# EAGLE design ExternalMotorController (EAGLE 6.4)

## Sheet 1 of 5
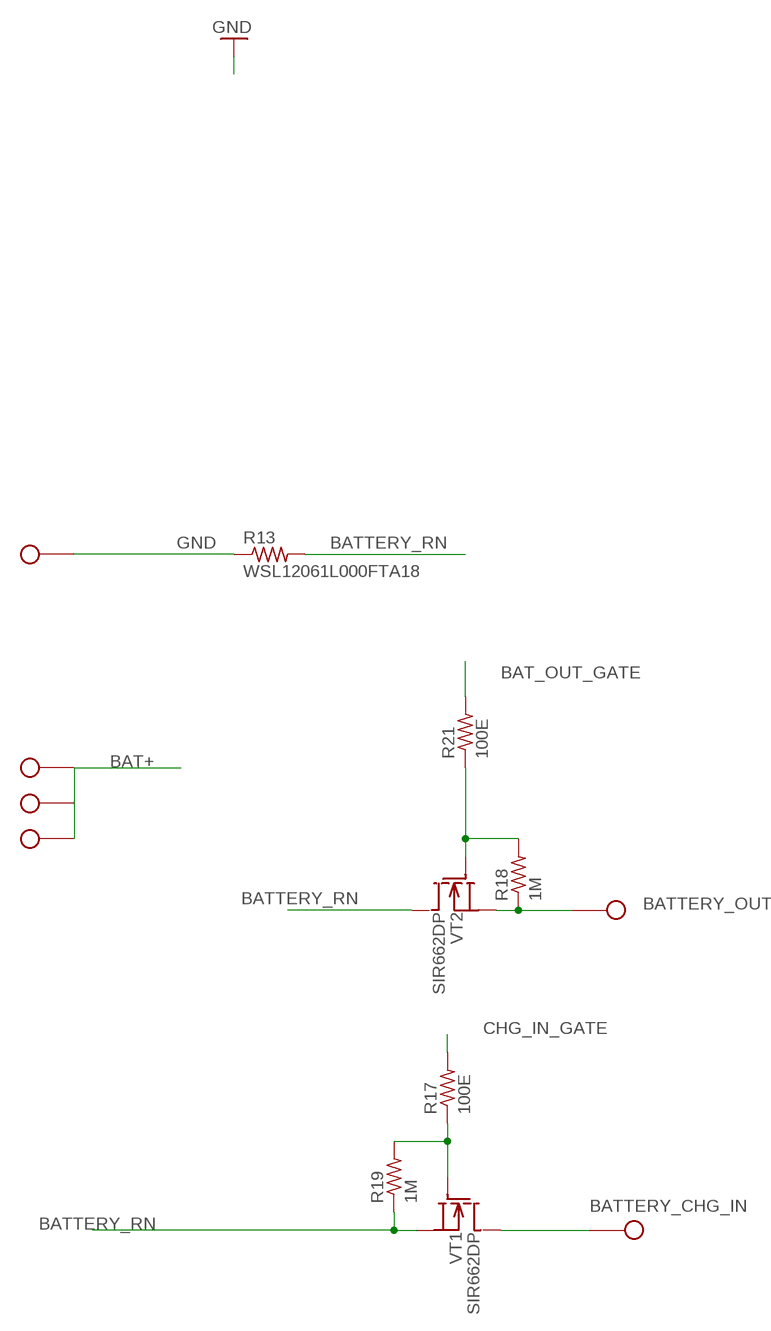
[diagram p0: schematic, sheet 1]

### Parts
R13  WSL12061L000FTA18  R-US_R2512  [R2512]
R17  100E  R-US_R0402  [R0402]
R18  1M  R-US_R0402  [R0402]
R19  1M  R-US_R0402  [R0402]
R21  100E  R-US_R0402  [R0402]
VT1  SIR662DP  [POWERPAK_SO8]
VT2  SIR662DP  [POWERPAK_SO8]
X1  SOLDER_HOLE18AWG  [SOLDER_HOLE_18]
X2  SOLDER_HOLE18AWG  [SOLDER_HOLE_18]
X3  SOLDER_HOLE18AWG  [SOLDER_HOLE_18]
X4  SOLDER_HOLE18AWG  [SOLDER_HOLE_18]
X5  SOLDER_HOLE18AWG  [SOLDER_HOLE_18]
X13  SOLDER_HOLE18AWG  [SOLDER_HOLE_18]

### Nets
BAT+: X1.1 X4.1 X5.1 ; also sheet 3,4
BAT_OUT_GATE: R21.2 ; also sheet 5
BATTERY_CHG_IN: VT1.D X2.1
BATTERY_OUT: R18.1 VT2.S1(S) VT2.S2(S) VT2.S3(S) X3.1 ; also sheet 5
BATTERY_RN: R13.2 R19.1 VT1.S1(S) VT1.S2(S) VT1.S3(S) VT2.D ; also sheet 5
CHG_IN_GATE: R17.2 ; also sheet 5
GND: R13.1 X13.1 ; also sheet 3,4,5
N$24: R18.2 R21.1 VT2.G
N$25: R17.1 R19.2 VT1.G

## Sheet 2 of 5

## Sheet 3 of 5
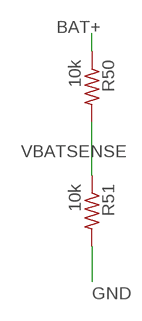
[diagram p1: schematic, sheet 3]

### Parts
R50  10k  R-US_R0402  [R0402]
R51  10k  R-US_R0402  [R0402]

### Nets
BAT+: R50.1 ; also sheet 1,4
GND: R51.2 ; also sheet 1,4,5
VBATSENSE: R50.2 R51.1 ; also sheet 5

## Sheet 4 of 5
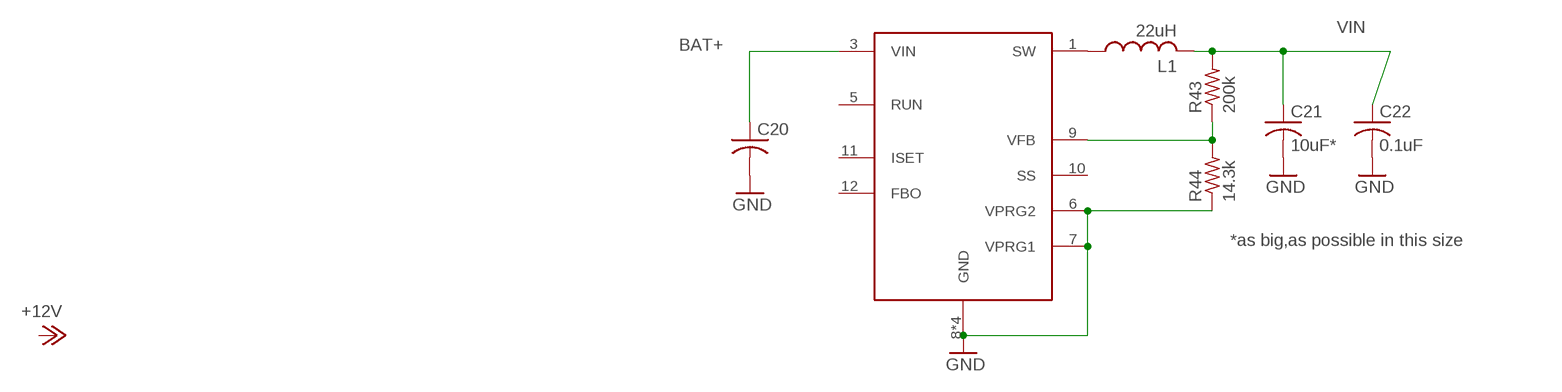
[diagram p2: schematic, sheet 4]

### Parts
C20  RCL_C-USC0805  [RCL_C0805$1]
C21  10uF*  RCL_C-USC4532  [RCL_C4532$1]
C22  0.1uF  C-USC0402  [C0402]
DA2  LTC3630  [MSE16(12)]
L1  22uH  M-PAD-2.1_L_USD  [M-PAD-2.1_1210]
R43  200k  RCL_R-US_R0402  [RCL_R0402]
R44  14.3k  RCL_R-US_R0402  [RCL_R0402]

### Nets
BAT+: C20.1 DA2.3(VIN) ; also sheet 1,3
GND: C20.2 C21.2 C22.2 DA2.6(VPRG2) DA2.7(VPRG1) DA2.8(GND) DA2.14(GND) DA2.16(GND) DA2.17(GND) R44.1 ; also sheet 1,3,5
N$51: DA2.1(SW) L1.1
N$52: DA2.9(VFB) R43.1 R44.2
VIN: C21.1 C22.1 L1.2 R43.2 ; also sheet 5
Unconnected: DA2.5(RUN) DA2.10(SS) DA2.11(ISET) DA2.12(FBO)

### Notes on the sheet
- *as big,as possible in this size

## Sheet 5 of 5
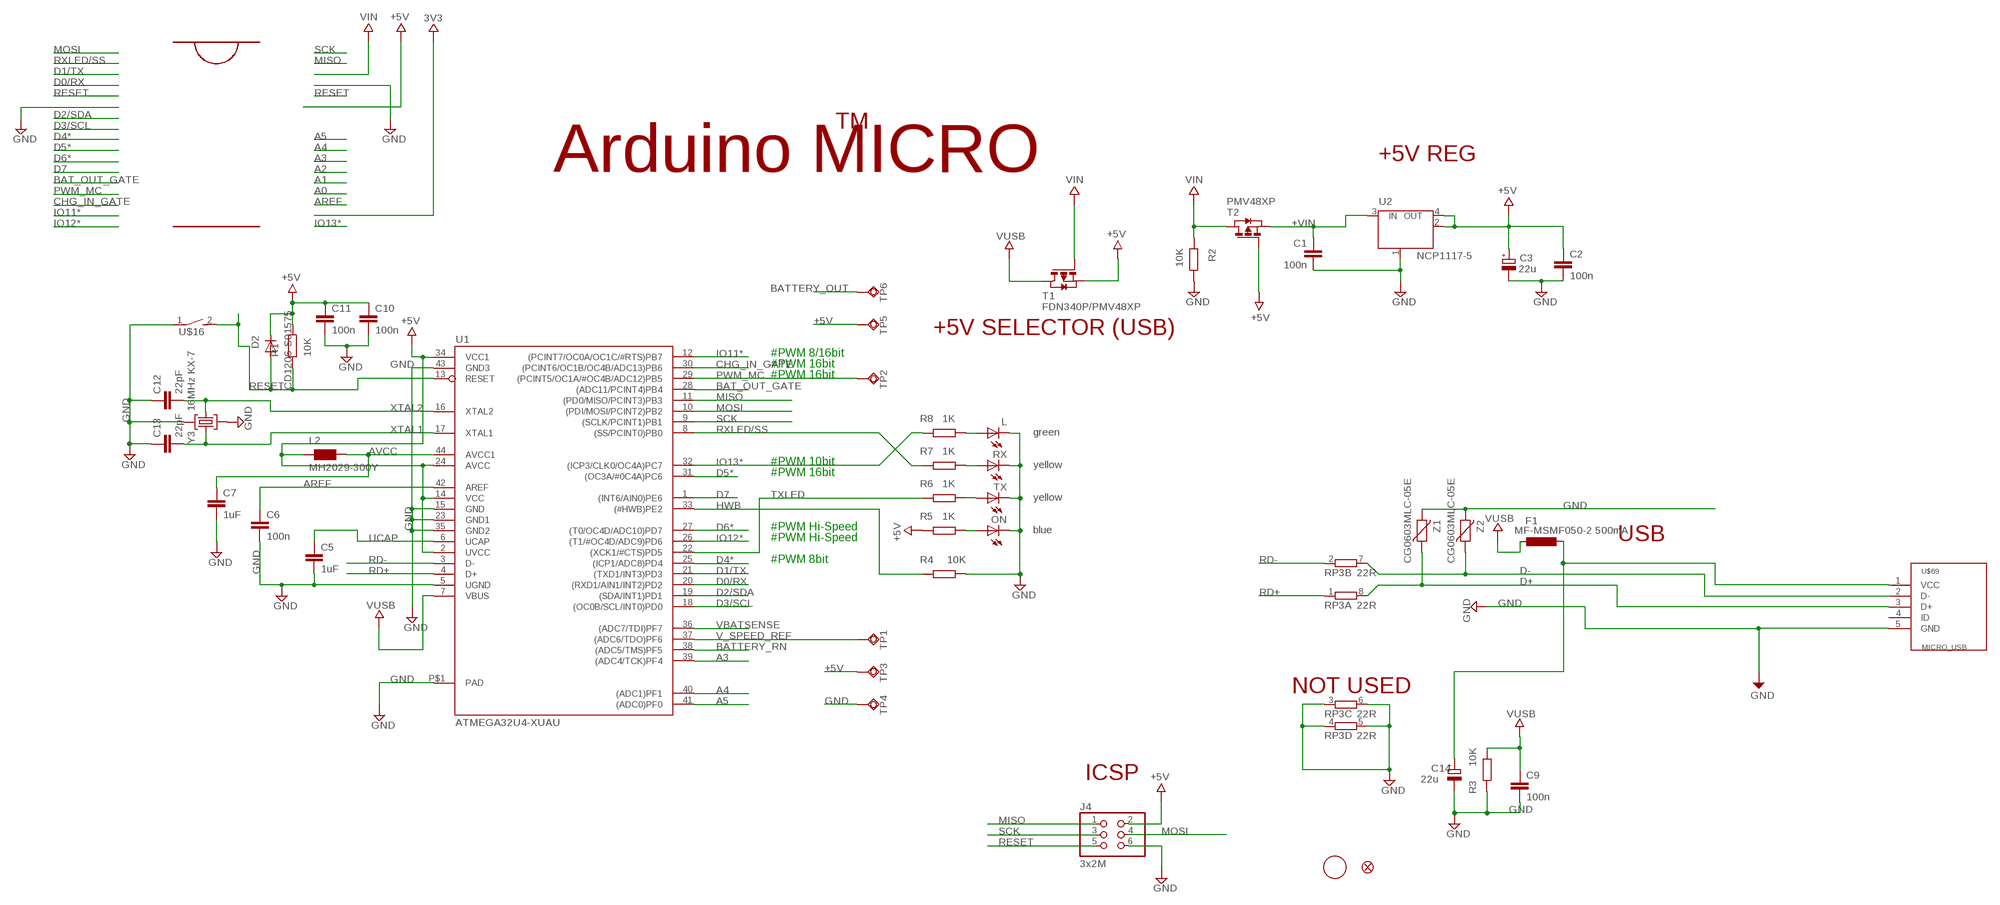
[diagram p3: schematic, sheet 5]

### Parts
C1  100n  C-EUC0402  [C0402]
C2  100n  C-EUC0402  [C0402]
C3  22u  CPOL-EUSMCB  [SMC_B]
C5  1uF  C-EUC0402  [C0402]
C6  100n  C-EUC0402  [C0402]
C7  1uF  C-EUC0402  [C0402]
C9  100n  C-EUC0402  [C0402]
C10  100n  C-EUC0402  [C0402]
C11  100n  C-EUC0402  [C0402]
C12  22pF  C-EUC0402  [C0402]
C13  22pF  C-EUC0402  [C0402]
C14  22u  CPOL-EUSMCB  [SMC_B]
D2  CD1206-S01575  DIODE-MINIMELF  [MINIMELF]
F1  MF-MSMF050-2 500mA  L-EUL1812  [L1812]
J4  3x2M  PINHD-2X3  [2X03]
L  green  LEDCHIPLED_0805  [CHIPLED_0805]
L2  MH2029-300Y  WE-CBF_0805  [0805]
ON  blue  LEDCHIPLED_0805  [CHIPLED_0805]
R1  10K  R-EU_R0402  [R0402]
R2  10K  R-EU_R0402  [R0402]
R3  10K  R-EU_R0402  [R0402]
R4  10K  R-EU_R0402  [R0402]
R5  1K  R-EU_R0402  [R0402]
R6  1K  R-EU_R0402  [R0402]
R7  1K  R-EU_R0402  [R0402]
R8  1K  R-EU_R0402  [R0402]
RP3  22R  4R-NCAY16  [CAY16]
RX  yellow  LEDCHIPLED_0805  [CHIPLED_0805]
T1  FDN340P/PMV48XP  PMOSSOT23  [SOT-23]
T2  PMV48XP  PMOSSOT23  [SOT-23]
TP1  TPSQTP15SQ  [TP15SQ]
TP2  TPSQTP15SQ  [TP15SQ]
TP3  TPSQTP15SQ  [TP15SQ]
TP4  TPSQTP15SQ  [TP15SQ]
TP5  TPSQTP15SQ  [TP15SQ]
TP6  TPSQTP15SQ  [TP15SQ]
TX  yellow  LEDCHIPLED_0805  [CHIPLED_0805]
U1  ATMEGA32U4-XUAU  [TQFP44-PAD]
U2  NCP1117-5  LINEAR_MC33269ST  [LINEAR_SOT223]
U$16  RGHT-ANGLE-SMT-SWITCH-688-SKRELF  [2.9X3.9X2.0]
U$37  FIDUCIALMOUNT  [FIDUCIA-MOUNT]
U$53  FIDUCIAL1X2  [FIDUCIAL-1X2]
U$69  MICRO_USB  [MICRO_USB]
Y3  16MHz KX-7  CRYSTAL-3.2-2.5  [CRYSTAL-3.2-2.5]
Z1  CG0603MLC-05E  VARISTORCN0603  [CT/CN0603]
Z2  CG0603MLC-05E  VARISTORCN0603  [CT/CN0603]

### Nets
+5V: C2.1 C3.+ C10.1 C11.1 D2.C J4.2 L2.1 R1.1 R5.1 T1.2(S) T2.3(G) TP3.TP TP5.TP U1.2(UVCC) U1.14(VCC) U1.24(AVCC) U1.34(VCC1) U2.2(OUT) U2.4(OUT)
+VIN: C1.1 T2.2(S) U2.3(IN)
A3: U1.39((ADC4/TCK)PF4)
A4: U1.40((ADC1)PF1)
A5: U1.41((ADC0)PF0)
AREF: C6.1 U1.42(AREF)
AVCC: C7.1 L2.2 U1.44(AVCC1)
BAT_OUT_GATE: U1.28((ADC11/PCINT4)PB4) ; also sheet 1
BATTERY_OUT: TP6.TP ; also sheet 1
BATTERY_RN: U1.38((ADC5/TMS)PF5) ; also sheet 1
CHG_IN_GATE: U1.30((PCINT6/OC1B/OC4B/ADC13)PB6) ; also sheet 1
D0/RX: U1.20((RXD1/AIN1/INT2)PD2)
D1/TX: U1.21((TXD1/INT3)PD3)
D2/SDA: U1.19((SDA/INT1)PD1)
D3/SCL: U1.18((OC0B/SCL/INT0)PD0)
D4*: U1.25((ICP1/ADC8)PD4)
D5*: U1.31((OC3A/#0C4A)PC6)
D6*: U1.27((T0/OC4D/ADC10)PD7)
D7: U1.1((INT6/AIN0)PE6)
D+: RP3.8 U$69.3(D+) Z1.1
D-: RP3.7 U$69.2(D-) Z2.1
GND: C1.2 C2.2 C3.- C5.2 C6.2 C7.2 C9.2 C10.2 C11.2 C12.1 C13.1 C14.- J4.6 L.C ON.C R2.1 R3.1 R4.2 RP3.3 RP3.4 RP3.5 RP3.6 RX.C TP4.TP TX.C U1.5(UGND) U1.15(GND) U1.23(GND1) U1.35(GND2) U1.43(GND3) U1.P$1(PAD) U2.1(GND/ADJ) U$16.1 U$69.5(GND) Y3.2(GND) Y3.4(GND) Z1.2 Z2.2 ; also sheet 1,3,4
HWB: R4.1 U1.33((#HWB)PE2)
IO11*: U1.12((PCINT7/OC0A/OC1C/#RTS)PB7)
IO12*: U1.26((T1/#OC4D/ADC9)PD6)
IO13*: R8.1 U1.32((ICP3/CLK0/OC4A)PC7)
MISO: J4.1 U1.11((PD0/MISO/PCINT3)PB3)
MOSI: J4.4 U1.10((PDI/MOSI/PCINT2)PB2)
N$2: R7.2 RX.A
N$3: ON.A R5.2
N$4: R6.2 TX.A
N$7: L.A R8.2
PWM_MC: TP2.TP U1.29((PCINT5/OC1A/#OC4B/ADC12)PB5)
RD+: RP3.1 U1.4(D+)
RD-: RP3.2 U1.3(D-)
RESET: D2.A J4.5 R1.2 U1.13(RESET) U$16.2
RXLED/SS: R7.1 U1.8((SS/PCINT0)PB0)
SCK: J4.3 U1.9((SCLK/PCINT1)PB1)
TXLED: R6.1 U1.22((XCK1/#CTS)PD5)
UCAP: C5.1 U1.6(UCAP)
V_SPEED_REF: TP1.TP U1.37((ADC6/TDO)PF6)
VBATSENSE: U1.36((ADC7/TDI)PF7) ; also sheet 3
VIN: R2.2 T1.3(G) T2.1(D) ; also sheet 4
VUSB: C9.1 F1.2 R3.2 T1.1(D) U1.7(VBUS)
VUSBD: C14.+ F1.1 U$69.1(VCC)
XTAL1: C13.2 U1.17(XTAL1) Y3.3(C2)
XTAL2: C12.2 U1.16(XTAL2) Y3.1(C1)
Unconnected: U$69.4(ID)

### Notes on the sheet
- TM
- +5V REG
- Arduino MICRO
- +5V SELECTOR (USB)
- #PWM 8/16bit
- #PWM 16bit
- #PWM 16bit
- #PWM 10bit
- #PWM 16bit
- #PWM Hi-Speed
- #PWM Hi-Speed | USB
- #PWM 8bit
- NOT USED
- ICSP

## Library data of the parts
C1 C2 C5-C7 C9-C13 = SmartPrj:C-EU: CAPACITOR, European symbol
C3 C14 = rcl:CPOL-EU: POLARIZED CAPACITOR, European symbol
C20 C21 = MotorController_r0:RCL_C-US: CAPACITOR, American symbol
C22 = rcl:C-US: CAPACITOR, American symbol
D2 = diode:DIODE-: DIODE
DA2 = my:LTC3630
F1 = rcl:L-EU: INDUCTOR, European symbol
J4 = SmartPrj:PINHD-2X3: PIN HEADER
L ON RX TX = led:LED: LED OSRAM: - CHIPLED LG R971, LG N971, LY N971, LG Q971, LY Q971, LO R971, LY R971 LH N974, LH R974 LS Q976, LO Q976, LY Q976 LO Q996 - Hyper CHIPLED LW Q18S LB Q993, LB Q99A, LB R99A - SideLED LS A670, LO A670, LY A670, LG A670, LP A670 LB A673, LV A673, LT A673, LW A673 LH A674 LY A675 LS A676, LA A676, LO A676, LY A676, LW A676 LS A679, LY A679, LG A679 - Hyper Micro SIDELED® LS Y876, LA Y876, LO Y876, LY Y876 LT Y87S - SmartLED LW L88C, LW L88S LB L89C, LB L89S, LG L890 LS L89K, LO L89K, LY L89K LS L896, LA L896, LO L896, LY L896 - TOPLED LS T670, LO T670, LY T670, LG T670, LP T670 LSG T670, LSP T670, LSY T670, LOP T670, LYG T670 LG T671, LOG T671, LSG T671 LB T673, LV T673, LT T673, LW T673 LH T674 LS T676, LA T676, LO T676, LY T676, LB T676, LH T676, LSB T676, LW T676 LB T67C, LV T67C, LT T67C, LS T67K, LO T67K, LY T67K, LW E67C LS E67B, LA E67B, LO E67B, LY E67B, LB E67C, LV E67C, LT E67C LW T67C LS T679, LY T679, LG T679 LS T770, LO T770, LY T770, LG T770, LP T770 LB T773, LV T773, LT T773, LW T773 LH T774 LS E675, LA E675, LY E675, LS T675 LS T776, LA T776, LO T776, LY T776, LB T776 LHGB T686 LT T68C, LB T68C - Hyper Mini TOPLED® LB M676 - Mini TOPLED Santana® LG M470 LS M47K, LO M47K, LY M47K Source: http://www.osram.convergy.de LUXEON: - LUMILED® LXK2-PW12-R00, LXK2-PW12-S00, LXK2-PW14-U00, LXK2-PW14-V00 LXK2-PM12-R00, LXK2-PM12-S00, LXK2-PM14-U00 LXK2-PE12-Q00, LXK2-PE12-R00, LXK2-PE12-S00, LXK2-PE14-T00, LXK2-PE14-U00 LXK2-PB12-K00, LXK2-PB12-L00, LXK2-PB12-M00, LXK2-PB14-N00, LXK2-PB14-P00, LXK2-PB14-Q00 LXK2-PR12-L00, LXK2-PR12-M00, LXK2-PR14-Q00, LXK2-PR14-R00 LXK2-PD12-Q00, LXK2-PD12-R00, LXK2-PD12-S00 LXK2-PH12-R00, LXK2-PH12-S00 LXK2-PL12-P00, LXK2-PL12-Q00, LXK2-PL12-R00 Source: www.luxeon.com KINGBRIGHT: KA-3528ASYC Source: www.kingbright.com
L1 = MotorController_r0:M-PAD-2.1_L_US: Inductors in various packages from: - Sumida - Panasonic - Coilcraft
L2 = wuerth-elektronik:WE-CBF: SMD EMI Suppression Ferrite Beads - excellent anti-EMI properties - low DCR - impedances till 3000 ohms - rated current up to 6 A
R1-R8 = SmartPrj:R-EU_: RESISTOR, European symbol
R13 R17-R19 R21 = ForBattery:R-US_: RESISTOR, American symbol
R43 R44 = MotorController_r0:RCL_R-US_: RESISTOR, American symbol
R50 R51 = rcl:R-US_: RESISTOR, American symbol
RP3 = resistor-dil:4R-N: Array Chip Resistor Source: RS Component / Phycomp
T1 T2 = zetex:PMOSSOT23: MOS FET
TP1-TP6 = testpad:TPSQ: Test pad
U1 = SmartPrj:ATMEGA32U4-XU
U2 = SmartPrj:LINEAR_MC33269ST*: Adjustable Output Low Dropout Voltage Regulator 800 mA Source: http://www.onsemi.com/pub/Collateral/MC33269-D.PDF
U$16 = m-pad-2.0:RGHT-ANGLE-SMT-SWITCH-688-SKRELF
U$37 = SmartPrj:FIDUCIALMOUNT
U$53 = SparkFun:FIDUCIAL: Fiducial Alignment Points Various fiducial points for machine vision alignment.
U$69 = camera_project:MICRO_USB
VT1 VT2 = ForBattery:SIR662DP
X1-X5 X13 = ForBattery:SOLDER_HOLE
Y3 = SmartPrj:CRYSTAL-3.2-2.5
Z1 Z2 = varistor:VARISTOR: VARISTOR

## Board
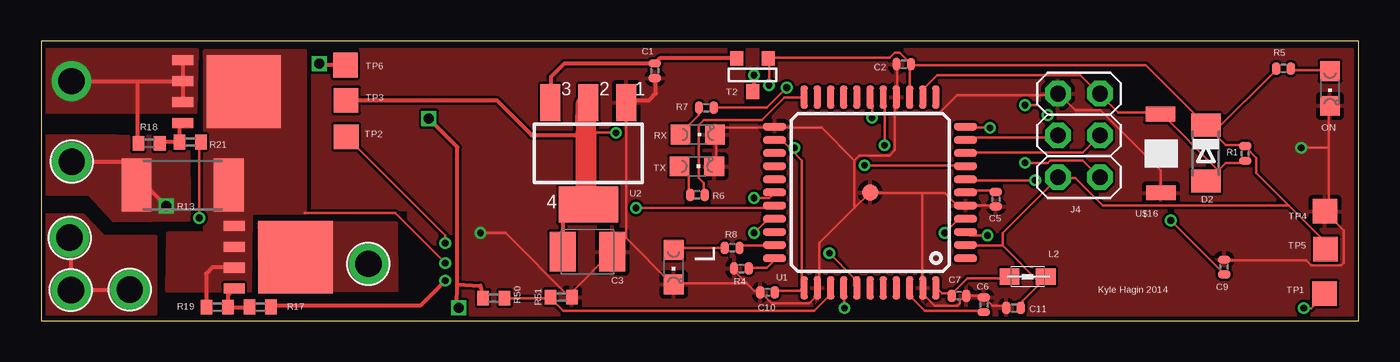
[diagram p4: board, top side]
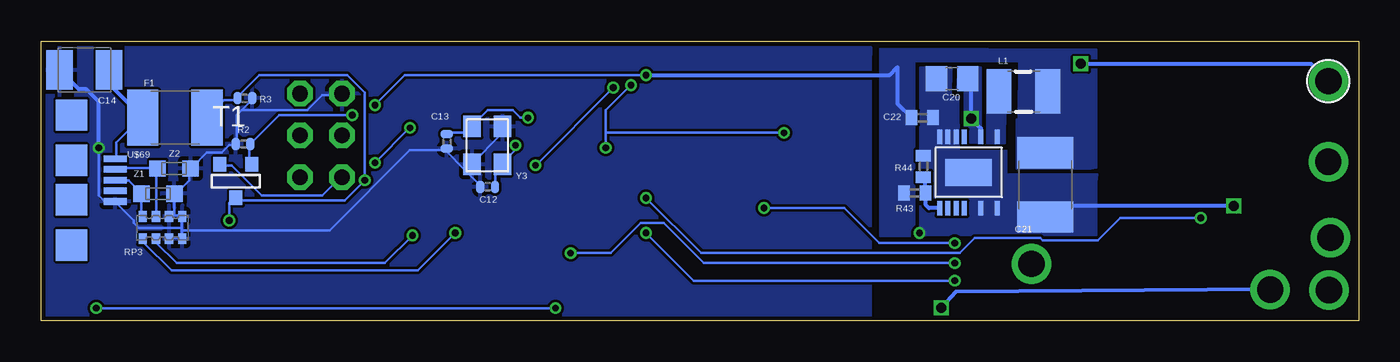
[diagram p5: board, bottom side, seen from below]

Size 80 x 17 mm. Coordinates in mm from the lower left corner, seen from the top.
Outline: 0,0 80,0 80,17 0,17 0,0
Copper layers (1*16): Top 0.035mm / dielectric 1.5mm / Bottom 0.035mm
Design rules "default *": minimum track width 6mil, minimum drill 16mil, track to track 6mil, track to pad 6mil, pad to pad 6mil, via to via 6mil, smd to smd 6mil, copper to edge 10mil, drill to drill 8mil, minimum pad ring 6mil, minimum via ring 6mil, stop-mask expansion 4mil, vias tented up to drill 0mil, thermal gap 10mil

### Footprints (pad centres in the part's own frame; a part is rotated, then mirrored left to right if it is on the bottom)
C0402 = smd 0.508 x 0.762: 1 -0.445,0; 2 0.445,0
SMC_B = smd 1.6 x 2.4: + -1.5,0; - 1.5,0
RCL_C0805$1 = smd 1.3 x 1.5: 1 -0.95,0; 2 0.95,0
RCL_C4532$1 = smd 1.9 x 3.4: 1 -1.95,0; 2 1.95,0
C0402' = smd 0.7 x 0.9: 1 -0.65,0; 2 0.65,0
MINIMELF = smd 1.4 x 1.8: A 1.7,0; C -1.7,0
MSE16(12) = smd 0.305 x 0.889: 1 -1.75,-2.171; 3 -0.75,-2.171; 5 0.25,-2.171; 6 0.75,-2.171; 7 1.25,-2.171; 8 1.75,-2.171; 9 1.75,2.171; 10 1.25,2.171; 11 0.75,2.171; 12 0.25,2.171; 14 -0.75,2.171; 16 -1.75,2.171 | smd 2.845 x 1.651: 17 0,0
L1812 = smd 1.9 x 3.4: 1 -1.95,0; 2 1.95,0
2X03 = drill 0.95 pad 1.55 octagon: 1 -2.54,-1.27; 2 -2.54,1.27; 3 0,-1.27; 4 0,1.27; 5 2.54,-1.27; 6 2.54,1.27
CHIPLED_0805 = smd 1.2 x 1.2: A 0,-1.05; C 0,1.05
M-PAD-2.1_1210 = smd 1.5 x 2.7: 1 -1.5,0; 2 1.45,0
0805 = smd 1.2 x 1: 1 -1.1,0; 2 1.1,0
R0402 = smd 0.508 x 0.762: 1 -0.445,0; 2 0.445,0
R2512 = smd 1.8 x 3.2: 1 -2.8,0; 2 2.8,0
R0402' = smd 0.7 x 0.9: 1 -0.65,0; 2 0.65,0
RCL_R0402 = smd 0.7 x 0.9: 1 -0.65,0; 2 0.65,0
CAY16 = smd 0.5 x 0.65: 1 -1.2,-0.675; 2 -0.4,-0.675; 3 0.4,-0.675; 4 1.2,-0.675; 5 1.2,0.675; 6 0.4,0.675; 7 -0.4,0.675; 8 -1.2,0.675
SOT-23 = smd 0.787 x 0.889: 1 0.025,-1.016; 2 -0.94,1.016; 3 0.991,1.016
TP15SQ = smd 1.5 x 1.5: TP 0,0
TQFP44-PAD = smd 1.4 x 0.45: 1 -5.8,4; 2 -5.8,3.2; 3 -5.8,2.4; 4 -5.8,1.6; 5 -5.8,0.8; 6 -5.8,0; 7 -5.8,-0.8; 8 -5.8,-1.6; 9 -5.8,-2.4; 10 -5.8,-3.2; 11 -5.8,-4; 23 5.8,-4; 24 5.8,-3.2; 25 5.8,-2.4; 26 5.8,-1.6; 27 5.8,-0.8; 28 5.8,0; 29 5.8,0.8; 30 5.8,1.6; 31 5.8,2.4; 32 5.8,3.2; 33 5.8,4 | smd 0.45 x 1.4: 12 -4,-5.8; 13 -3.2,-5.8; 14 -2.4,-5.8; 15 -1.6,-5.8; 16 -0.8,-5.8; 17 0,-5.8; 18 0.8,-5.8; 19 1.6,-5.8; 20 2.4,-5.8; 21 3.2,-5.8; 22 4,-5.8; 34 4,5.8; 35 3.2,5.8; 36 2.4,5.8; 37 1.6,5.8; 38 0.8,5.8; 39 0,5.8; 40 -0.8,5.8; 41 -1.6,5.8; 42 -2.4,5.8; 43 -3.2,5.8; 44 -4,5.8 | smd 1 x 1: P$1 0,0
LINEAR_SOT223 = smd 1.219 x 2.235: 1 -2.311,-3.099; 2 0,-3.099; 3 2.311,-3.099 | smd 3.6 x 2.2: 4 0,3.099
2.9X3.9X2.0 = smd 0.9 x 1.8: 1 -2.394,0.008; 2 2.379,0.032
FIDUCIA-MOUNT = smd 1.016 x 1.016: P$1 0,0
FIDUCIAL-1X2 = smd 1 x 1: 1 0,0
MICRO_USB = smd 0.4 x 1.4: 1 -1.3,0; 2 -0.65,0; 3 0,0; 4 0.65,0; 5 1.3,0 | smd 1.9 x 1.9: P$6 3.95,-2.65; P$7 -3.95,-2.65; P$8 -1.2,-2.65; P$9 1.2,-2.65
POWERPAK_SO8 = smd 4.52 x 4.42: D 3.715,0 | smd 1.27 x 0.61: G 0,-1.905; S1 0,1.905; S2 0,0.635; S3 0,-0.635
SOLDER_HOLE_18 = drill 1.6: 1 0,0
CRYSTAL-3.2-2.5 = smd 1.3 x 1.05: 1 -1.15,-0.925; 2 1.15,-0.925; 3 1.15,0.925; 4 -1.15,0.925
CT/CN0603 = smd 1 x 1: 1 -1,0; 2 1,0

### Placement (x,y rotation side)
C1  37.26,15.2 270 top
C2  52.37,15.59 180 top
C3  33.17,4.2 0 top
C5  57.97,7.39 270 top
C6  57.24,0.97 90 top
C7  55.72,1.53 0 top
C9  71.82,3.27 90 top
C10  44.1,1.73 180 top
C11  59.04,0.78 180 top
C12  52.89,8.14 0 bottom
C13  55.36,10.9 90 bottom
C14  77.38,15.25 180 bottom
C20  24.69,14.72 180 bottom
C21  19.04,8.26 270 bottom
C22  0.1uF  [C0402']  26.5,12.35 0 bottom
D2  70.72,10.18 270 top
DA2  23.7,9.01 180 bottom
F1  71.88,12.34 0 bottom
J4  63.01,11.27 90 top
L  38.4,3.26 180 top
L1  20.34,13.93 0 bottom
L2  59.9,2.68 180 top
ON  78.25,14.12 180 top
R1  73.1,10.17 270 top
R2  67.74,10.74 0 bottom
R3  67.64,13.53 180 bottom
R4  42.51,3.18 180 top
R5  75.43,15.33 0 top
R6  39.84,7.66 180 top
R7  40.38,12.95 180 top
R8  41.95,4.44 180 top
R13  8.59,8.25 0 top
R17  100E  [R0402']  13.31,0.84 0 top
R18  1M  [R0402']  6.55,10.79 0 top
R19  1M  [R0402']  10.7,0.83 0 top
R21  100E  [R0402']  9.04,10.86 0 top
R43  26.96,7.76 180 bottom
R44  26.44,9.38 270 bottom
R50  10k  [R0402']  27.48,1.38 0 top
R51  10k  [R0402']  31.58,1.44 0 top
RP3  72.63,5.66 0 bottom
RX  39.87,11.32 270 top
T1  68.21,8.49 0 bottom
T2  43.16,14.94 0 top
TP1  77.92,1.65 0 top
TP2  18.52,11.18 0 top
TP3  18.51,13.4 0 top
TP4  77.95,6.66 0 top
TP5  77.97,4.35 0 top
TP6  18.47,15.53 0 top
TX  39.81,9.39 270 top
U1  50.33,7.8 180 top
U2  33.22,10.17 180 top
U$16  67.99,10.17 90 top
U$37  122.89,17.61 0 top  (outside the outline)
U$53  125.5,18.19 0 top  (outside the outline)
U$69  75.5,8.55 270 bottom
VT1  11.72,3.86 0 top
VT2  8.59,13.93 0 top
X1  1.8,1.86 0 top
X2  19.87,3.46 0 top
X3  1.85,14.57 0 bottom
X4  1.73,5.04 0 top
X5  5.38,1.9 0 top
X13  1.85,9.67 0 top
Y3  52.91,10.66 90 bottom
Z1  72.91,7.73 0 bottom
Z2  71.93,9.25 0 bottom

### Tracks (layer width: path | path; a pad name or v marks a point on that pad's centre or on a via)
+5V  (via drill 0.41)
  Top 0.152: 60.66,2.29 60.96,2.59 L2.1 60.66,2.29 | 60.66,2.29 59.59,1.22 59.59,0.91 C11.1 | 58.37,4.57 56.24,4.57 U1.2 | 60.66,2.29 58.37,4.57 | 58.37,4.57 58.37,5.33 61.72,8.69 J4.2 61.87,8.69 62.79,8.69 64.47,7.01 75.74,7.01 | 31.7,4.27 C3.+ | 33.07,7.01 U2.4 33.07,7.16 | C10.1 44.65,1.83 46.02,1.83 46.18,1.98 U1.34 46.18,2.13 46.18,9.75 45.57,10.36 | 45.57,10.36 44.96,10.97 44.65,10.97 U1.24 | C2.1 52.73,15.54 52.73,13.72 U1.14 | C2.1 52.73,15.7 52.12,16.31 51.82,16.31 51.51,16 44.2,16 T2.3 44.2,15.85 v44.2,14.33 | 71.17,11.43 70.87,11.73 D2.C | 71.17,11.43 71.93,10.67 73,10.67 R1.1 73.15,10.52 73.76,9.91 73.76,8.99 75.74,7.01 | 71.17,11.43 74.98,15.24 R5.1 | 71.17,11.43 D2.C | 75.74,7.01 77.88,4.88 77.88,4.42 TP5.TP | C2.1 52.88,15.54 67.06,15.54 D2.C | v45.72,10.52 45.57,10.36 | v34.9,11.43 33.07,11.43 33.03,11.47
  Top 0.254: TP3.TP 27.65,13.4 29.77,11.28 32.84,11.28 33.03,11.47 33.06,11.9 | 33.09,13.14 U2.2 | 31.7,4.27 31.7,6.09 32.66,7.05 33.2,7.05 U2.4
  Top 1.27: 33.06,11.9 33.09,13.14 | 33.07,11.43 33.07,7.16
  Bottom 0.152: T1.2 69.04,9.45 68.43,9.45 66.6,7.62 62.94,7.62 61.87,8.69 J4.2 | 45.72,11.43 45.72,12.8 v44.2,14.33 | 45.72,11.43 v45.72,10.52 | 45.72,11.43 v34.9,11.43
+VIN
  Top 0.254: T2.2 37.57,15.96 C1.1 31.77,15.64 30.95,14.82 30.95,13.3 U2.3
AREF
  Top 0.152: C6.1 57.15,0.61 53.65,0.61 52.73,1.52 52.73,1.98 U1.42 52.73,2.13
AVCC
  Top 0.152: U1.44 54.41,1.98 54.71,1.68 55.17,1.68 C7.1 55.32,1.68 56.24,2.59 58.67,2.59 L2.2
BAT+  (via drill 0.6)
  Top 0.254: X4.1 1.8,5.04 X1.1 5.38,1.86 X5.1 | 25.27,2.21 26.67,2.13 R50.1 | v25.36,0.78 25.23,0.87 25.27,2.21 | 25.27,2.21 25.27,10.54 v23.54,12.28
  Bottom 0.254: DA2.3 22.95,11.69 v23.54,12.28 23.54,14.52 C20.1 | X5.1 24.46,1.76 v25.36,0.78
  pour Bottom (no thermals): 22.96,10.83 22.96,15.37 24.3,15.37 24.37,14.12 23.93,14.1 23.91,10.82 23.27,10.82
  pour Top (no thermals): 0.3,6.42 2.51,6.42 3.77,5.12 6.94,5.12 6.94,0.43 0.3,0.43
BAT_OUT_GATE  (via drill 0.41)
  Top 0.152: v9.6,6.25 9.6,10.82 R21.2 | v43.28,7.47 44.2,7.47 44.5,7.77 U1.28
  Bottom 0.152: v9.6,6.25 14.48,6.25 15.85,4.88 19.2,4.88 19.36,5.03 23.32,5.03 24.23,4.12 39.93,4.12 v43.28,7.47
BATTERY_CHG_IN
  pour Top (no thermals): 13.22,5.93 21.53,5.93 21.57,1.84 13.3,1.84 13.26,5.46
BATTERY_OUT  (via drill 0.6)
  Top 0.254: X3.1 5.85,14.57 | 5.85,14.57 VT2.S2 | VT2.S1 VT2.S2 | VT2.S2 VT2.S3 | R18.1 5.85,10.79 5.85,14.57 | TP6.TP 16.96,15.53 v16.87,15.62
  Bottom 0.254: v16.87,15.62 2.91,15.62 X3.1
  pour Top (no thermals): 0.17,12.71 9.38,12.71 9.47,16.46 0.26,16.46 0.3,13.36
BATTERY_RN  (via drill 0.41)
  Top 0.152: v47.85,4.12 49.38,2.59 49.38,2.13 U1.38 | v24.54,3.5 21.49,6.55 16,6.55
  Top 0.254: VT1.S3 10.38,3.23 10.01,2.86 10.01,0.87 R19.1
  Bottom 0.152: v47.85,4.12 45.41,4.12 43.59,5.94 42.22,5.94 39.78,3.5 v24.54,3.5
  pour Top (no thermals): 9.93,16.42 16.01,16.42 16.01,6.54 12.73,6.54 12.67,1.81 7.67,1.81 7.73,5.33 9.96,5.33 9.96,15.54
CHG_IN_GATE  (via drill 0.41)
  Top 0.152: v43.28,5.33 44.04,6.1 44.5,6.1 U1.30 | 14.02,0.91 R17.2
  Top 0.254: 14.02,0.91 23.01,0.91 v24.54,2.44
  Bottom 0.152: v24.54,2.44 40.39,2.44 v43.28,5.33
D+
  Bottom 0.152: RP3.8 73.91,6.4 73.91,7.62 Z1.1 73.91,7.77 74.68,8.53 75.44,8.53 U$69.3
D-
  Bottom 0.152: RP3.7 73,6.4 73,9.14 Z2.1 73,9.3 75.44,9.3 U$69.2
GND  (via drill 0.41, 0.6)
  Top 0.152: U$16.1 67.97,7.92 67.97,9.14 64.31,12.8 62.79,12.8 61.87,13.72 J4.6 61.72,13.72 55.63,13.72 54.56,12.65 51.82,12.65 | 78.18,6.4 78.03,6.55 TP4.TP 78.18,6.4 | 78.18,6.4 79.1,5.49 79.1,3.5 78.94,3.35 77.11,3.35 76.81,3.66 71.93,3.66 C9.2 | 78.18,6.4 78.18,10.52 | 78.18,10.52 78.18,12.95 ON.C | v76.5,10.52 78.18,10.52 | 42.82,2.29 42.06,3.05 R4.2 | 42.82,2.29 43.28,1.83 43.59,1.83 C10.2 43.74,1.68 44.35,1.07 46.63,1.07 47.09,1.52 47.09,1.98 U1.35 47.24,2.13 47.24,4.72 49.38,6.86 | 42.82,2.29 38.41,2.29 L.C 38.25,2.29 35.51,5.03 | 35.51,13.41 U2.1 35.51,13.26 35.51,5.03 | 35.51,5.03 34.75,4.27 C3.- 34.59,4.12 32.31,1.83 32.31,1.52 R51.2 32.16,1.37 28.19,5.33 v26.67,5.33 | TX.C 41,9.45 41,11.28 RX.C 41,11.43 41.3,11.73 44.5,11.73 U1.23 44.65,11.73 47.4,11.73 49.38,9.75 | C2.2 51.97,15.54 51.97,13.72 U1.15 51.82,13.56 51.82,12.65 | C11.2 58.52,0.91 57.76,0.91 57.3,1.37 C6.2 57.15,1.52 56.24,1.52 C7.2 56.08,1.52 55.78,1.22 55.78,1.07 55.63,0.91 54.25,0.91 53.65,1.52 53.65,1.98 U1.43 53.49,2.13 53.49,7.77 | C5.2 57.91,7.01 56.24,7.01 U1.5 56.08,7.01 55.63,7.01 54.86,7.77 53.49,7.77 | 53.49,7.77 50.44,7.77 U1.P$1 50.29,7.77 49.38,6.86 | 51.82,12.65 51.82,10.36 51.51,10.06 49.68,10.06 49.38,9.75 | 49.38,6.86 49.38,9.75
  Top 0.254: X13.1 5.79,9.67 R13.1 6.32,8.25 v7.59,6.99 | 35.51,13.41 36.91,13.41 37.33,13.82 37.33,14.68 C1.2
  Bottom 0.152: 55.47,10.36 54.25,9.14 | 54.25,9.14 53.34,8.23 C12.1 | 54.25,9.14 53.95,9.45 Y3.4 53.8,9.6 52.12,11.28 52.12,11.73 Y3.2 | 67.82,12.8 67.21,13.41 R3.1 | 67.82,12.8 68.12,12.5 68.12,10.82 R2.1 68.28,10.67 68.58,10.67 69.04,10.21 69.95,10.21 70.87,9.3 Z2.2 71.02,9.14 71.02,8.53 71.78,7.77 Z1.2 71.93,7.62 71.93,6.4 | 71.48,5.03 72.08,5.03 RP3.3 | 71.93,6.4 72.08,6.4 RP3.6 | 71.93,6.4 71.48,6.4 RP3.5 71.48,6.25 71.48,5.64 | 71.48,5.64 71.48,5.49 | 71.48,5.49 71.48,5.03 | 71.48,5.03 RP3.4 | 71.48,5.64 74.07,5.64 74.37,5.94 74.37,6.1 75.44,7.16 U$69.5 75.59,7.32 76.2,7.32 76.5,7.62 v76.5,10.52 | 55.47,10.36 57.61,10.36 62.48,5.49 71.48,5.49 | 55.47,10.36 C13.1 | 67.82,12.8 63.86,12.8 62.94,13.72 61.87,13.72 J4.6 | v26.67,5.33 26.62,5.33
  Bottom 0.254: v7.59,6.99 18.5,6.99 C21.2 | v76.5,10.52 76.5,13.31 77.28,14.08 77.71,14.08 C14.-
  pour Bottom (no thermals): 15.88,8.9 21.4,8.9 21.4,10.34 24.29,10.3 24.33,13.62 24.77,13.6 24.76,15.39 26.62,15.39 26.62,5.23 15.93,5.23 15.93,8.4
  pour Top (no thermals): 0.35,11.26 8.92,11.2 8.97,6.13 4.43,6.06 2.93,7.69 0.39,7.69
  pour Top: 16.43,16.49 79.56,16.49 79.56,0.31 22.36,0.31 22.36,6.75 16.51,6.75 16.51,14.86
  pour Bottom: 29.6,16.56 79.62,16.56 79.62,0.25 29.66,0.25 29.66,16.01
HWB
  Top 0.152: R4.1 42.98,3.2 44.04,3.2 44.5,3.66 U1.33
IO13*
  Top 0.152: R8.1 42.52,4.57 44.5,4.57 U1.32
MISO  (via drill 0.41)
  Top 0.152: v57.61,11.73 56.24,11.73 U1.11 | v59.74,9.6 61.11,9.6 61.27,9.75 63.25,9.75 64.16,8.84 J4.1
  Bottom 0.152: v59.74,9.6 v57.61,11.73
MOSI
  Top 0.152: U1.10 56.24,11.12 61.72,11.12 J4.4
N$2
  Top 0.152: R7.2 39.93,12.8 39.93,12.5 38.86,11.43 RX.A
N$3
  Top 0.152: R5.2 75.89,15.24 78.18,15.24 ON.A
N$4
  Top 0.152: R6.2 39.32,7.77 39.32,8.84 38.86,9.3 TX.A
N$7
  Top 0.152: R8.2 41.45,4.42 38.41,4.42 L.A
N$24
  Top 0.254: VT2.G 8.39,12.03 R21.1 7.2,10.86 R18.2
N$25
  Top 0.254: VT1.G 11.35,1.59 R19.2 12.65,0.83 R17.1
N$51
  pour Bottom (no thermals): 21.43,15.17 21.5,10.81 22.56,10.8 22.55,15.21 21.64,15.21
N$52
  Bottom 0.254: DA2.9 26.11,6.84 26.29,7.03 26.29,7.74 R43.1 26.31,8.61 R44.2
PWM_MC  (via drill 0.41)
  Top 0.152: v36.12,6.86 44.5,6.86 U1.29 | v24.54,4.72 24.54,5.18 18.59,11.12 TP2.TP
  Bottom 0.152: v36.12,6.86 31.24,6.86 29.11,4.72 v24.54,4.72
RD+  (via drill 0.41)
  Top 0.152: v54.86,5.33 55.63,6.1 56.08,6.1 U1.4
  Bottom 0.152: v54.86,5.33 57.15,3.05 72.08,3.05 73.76,4.72 73.76,4.88 RP3.1
RD-  (via drill 0.41)
  Top 0.152: v57.45,5.18 56.39,5.18 56.24,5.33 U1.3
  Bottom 0.152: v57.45,5.18 59.13,3.5 71.78,3.5 73,4.72 73,4.88 RP3.2
RESET
  Top 0.152: 71.48,9.14 70.87,8.53 D2.A 71.48,9.14 | 71.48,9.14 71.93,9.6 73,9.6 R1.2 | U1.13 53.65,13.72 53.65,14.17 54.41,14.94 63.09,14.94 64.16,13.87 J4.5 64.31,13.72 65.38,12.65 67.82,12.65 U$16.2 67.97,12.65 71.48,9.14
RXLED/SS  (via drill 0.41)
  Top 0.152: v45.26,14.17 44.04,12.95 40.84,12.95 R7.1 | v49.99,9.45 56.08,9.45 U1.8
  Bottom 0.152: v49.99,9.45 v45.26,14.17
SCK
  Top 0.152: U1.9 56.24,10.21 63.25,10.21 64.16,11.12 J4.3
TXLED
  Top 0.152: R6.1 40.23,7.77 40.23,8.38 39.93,8.69 39.93,11.89 40.23,12.19 43.74,12.19 45.11,13.56 46.18,13.56 U1.22
UCAP
  Top 0.152: C5.1 57.91,7.92 56.24,7.92 U1.6
V_SPEED_REF  (via drill 0.41)
  Top 0.152: v48.77,0.76 48.77,1.98 U1.37 | v76.66,0.76 77.11,0.76 77.88,1.52 TP1.TP
  Bottom 0.152: v76.66,0.76 v48.77,0.76
VBATSENSE
  Top 0.152: R50.2 28.19,1.37 30.79,1.37 R51.1 30.94,1.37 31.7,0.61 46.94,0.61 47.85,1.52 47.85,1.98 U1.36
VIN  (via drill 0.41)
  Top 0.152: v59.74,13.11 60.5,13.11 v61.11,12.5 | 43.28,14.02 T2.1
  Top 0.254: 43.28,14.02 v43.28,14.94
  Bottom 0.152: T1.3 67.36,9.6 67.36,10.67 R2.2 67.21,10.82 65.53,12.5 v61.11,12.5 | v43.28,14.94 57.91,14.94 v59.74,13.11
  Bottom 0.254: v43.28,14.94 28.49,14.94 28.02,15.41 28.02,13.21 C22.1
  pour Bottom (no thermals): 15.93,9.3 15.93,16.48 29.04,16.54 29.04,5.15 26.98,5.15 26.98,15.78 20.6,15.78 20.66,12.22 20.77,12.24 20.77,9.25 16.38,9.24
  pour Bottom: 17.37,10.58 20.61,10.58 20.61,12.19 17.3,12.19 17.3,10.96
VUSB  (via drill 0.41)
  Top 0.152: v68.58,6.1 71.78,2.9 C9.1 | v60.35,8.53 56.24,8.53 U1.7
  Bottom 0.152: F1.2 69.8,12.5 68.89,13.41 68.12,13.41 R3.2 67.97,13.56 67.97,13.72 66.75,14.94 61.42,14.94 60.35,13.87 v60.35,8.53 61.57,7.32 68.43,7.32 | v68.58,6.1 68.58,7.16 68.43,7.32 | 68.43,7.32 68.28,7.47 T1.1 68.43,7.32
VUSBD
  Bottom 0.152: U$69.1 75.44,9.91 75.44,10.82 73.91,12.34 F1.1 73.76,12.34
  Bottom 0.254: C14.+ 75.88,14.39 F1.1
XTAL1  (via drill 0.41)
  Top 0.152: v50.44,12.34 50.44,13.56 U1.17
  Bottom 0.152: C13.2 55.32,11.43 54.25,11.43 53.95,11.73 Y3.3 53.8,11.89 52.88,12.8 51.36,12.8 50.9,12.34 v50.44,12.34
XTAL2  (via drill 0.41)
  Top 0.152: v51.21,10.67 51.21,13.56 U1.16
  Bottom 0.152: C12.2 52.43,8.23 52.43,9.14 52.12,9.45 Y3.1 51.97,9.6 51.21,10.36 v51.21,10.67

### Text on the board
tNames: Kyle Hagin 2014